# EAGLE design LNA-SMA (EAGLE 7.2.0)
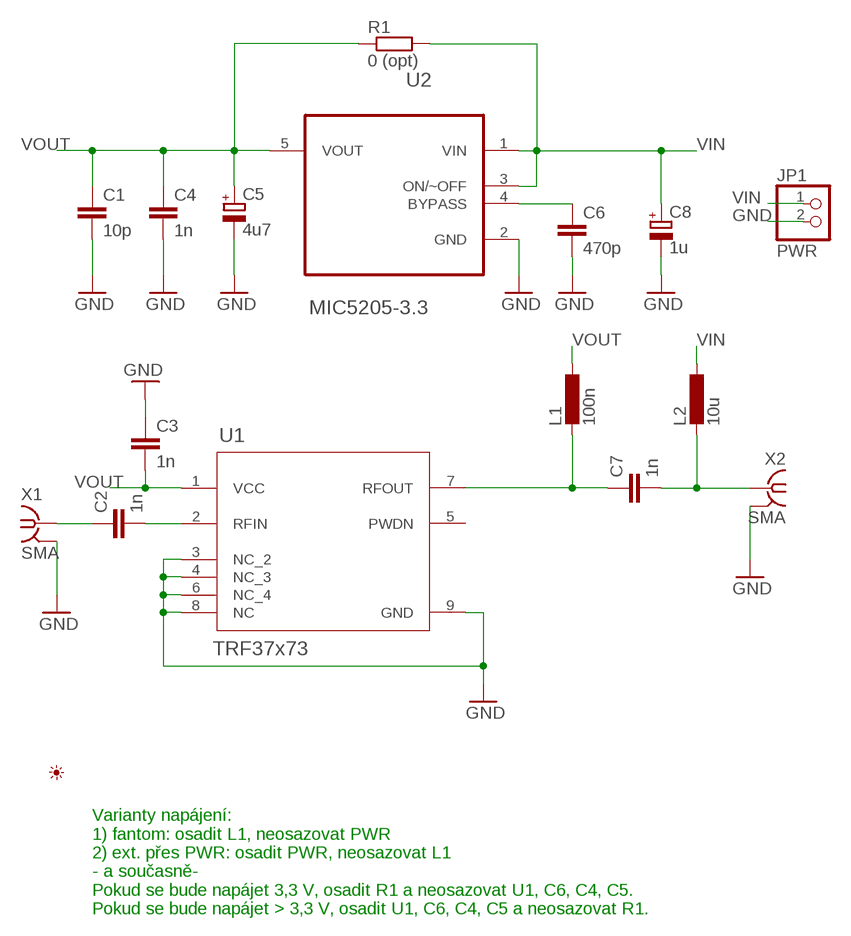
[diagram p0: schematic, sheet 1]

## Parts
C1  10p  C-EUC0603  [C0603]
C2  1n  C-EUC0603  [C0603]
C3  1n  C-EUC0603  [C0603]
C4  1n  C-EUC0603  [C0603]
C5  4u7  CPOL-EUSMCA  [SMC_A]
C6  470p  C-EUC0603  [C0603]
C7  1n  C-EUC0603  [C0603]
C8  1u  CPOL-EUSMCA  [SMC_A]
JP1  PWR  PINHD-1X2  [1X02]
L1  100n  L-EUL2012C  [L2012C]
L2  10u  L-EUL2012C  [L2012C]
R1  0 (opt)  R-EU_R0603  [R0603]
U1  TRF37x73  TRF37D73IDSGR  [DSG0008A]
U2  MIC5205-3.3  LP2985A-18DBVJ  [SOT95P280X145-5N]
U$1  PICTO_1  [PICTO_1]
X1  SMA  SMA-142-0701-801/806  [J502-ND-142-0701-801/806]
X2  SMA  SMA-142-0701-801/806  [J502-ND-142-0701-801/806]

## Nets
GND: C1.2 C3.1 C4.2 C5.- C6.2 C8.- JP1.2 U1.3(NC_2) U1.4(NC_3) U1.6(NC_4) U1.8(NC) U1.9(GND) U2.2(GND) X1.G@1 X1.G@2 X1.G@3 X1.G@4 X2.G@1 X2.G@2 X2.G@3 X2.G@4
N$1 [net]: C6.1 U2.4(BYPASS)
N$2 [RF]: C2.2 U1.2(RFIN)
N$3 [RF]: C7.1 L1.2 U1.7(RFOUT)
RF_IN [RF]: C7.2 L2.2 X2.1
RF_OUT [RF]: C2.1 X1.1
VIN [net]: C8.+ JP1.1 L2.1 R1.2 U2.1(VIN) U2.3(ON/~OFF)
VOUT [net]: C1.1 C3.2 C4.1 C5.+ L1.1 R1.1 U1.1(VCC) U2.5(VOUT)
Unconnected: U1.5(PWDN)

## Notes on the sheet
- Varianty napájení:
  1) fantom: osadit L1, neosazovat PWR
  2) ext. přes PWR: osadit PWR, neosazovat L1
  - a současně-
  Pokud se bude napájet 3,3 V, osadit R1 a neosazovat U1, C6, C4, C5.
  Pokud se bude napájet > 3,3 V, osadit U1, C6, C4, C5 a neosazovat R1.

## Library data of the parts
C1-C4 C6 C7 = rcl:C-EU: CAPACITOR, European symbol
C5 C8 = rcl:CPOL-EU: POLARIZED CAPACITOR, European symbol
JP1 = pinhead:PINHD-1X2: PIN HEADER
L1 L2 = rcl:L-EU: INDUCTOR, European symbol
R1 = rcl:R-EU_: RESISTOR, European symbol
U1 = Texas Instruments:TRF37D73IDSGR; ALTERNATEPARTNUMBER: TRF37D73IDSGT; APPLICATION_BUILDNUMBER: *; COMPTYPE: IC; MANUFACTURER: Texas Instruments; MOUNTTYPE: SMT; PACKAGEREFERENCE: DSG0008A; PARTNUMBER: TRF37D73IDSGR; PIN_COUNT: 9; REFDES: RefDes; ROHS: Y; TYPE: TYPE; VALUE: Value
U2 = Texas Instruments_By_element14_Batch_1:LP2985A-18DBVJ: 150-mA LOW-NOISE LOW-DROPOUT REGULATOR; MPN: LP2985A-18DBVJ; OC_FARNELL: 1924808; OC_NEWARK: 58T1987; PACKAGE: SOT-23-5; SUPPLIER: Texas Instruments
U$1 = My_Picto:PICTO_1: Zdenek Brichacek; OK3ZB; http://blog.brichacek.net
X1 X2 = con-coax:SMA-: SMA 50 Ohm End Launch Jack Receptacle - Round Contact Johnson Components Source: www.johnsoncomponents.com .. J502-ND.pdf; MF: JOHNSON COMPONENTS; MPN: 142-0701-801; OC_FARNELL: 1608592; OC_NEWARK: 90F2624

## Net classes
1 RF: width 2.4 mm, clearance 0.406 mm
2 net: width 0.6 mm, clearance 0.254 mm

## Board
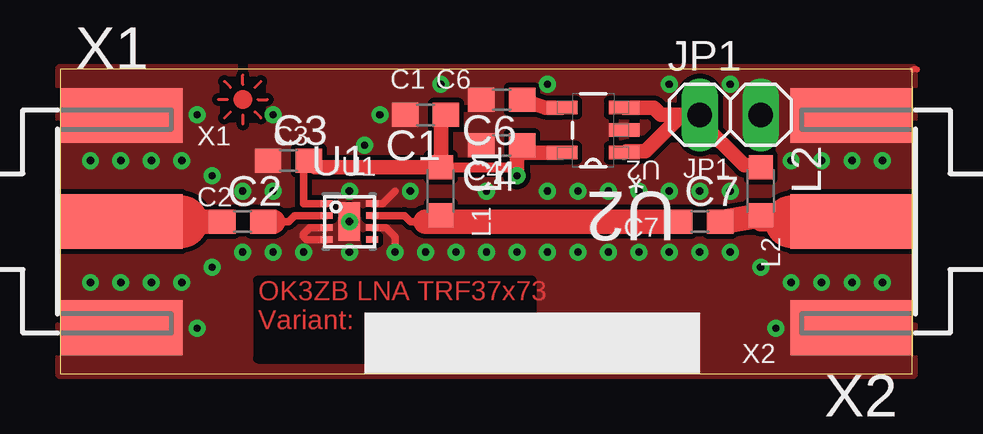
[diagram p1: board, top side]
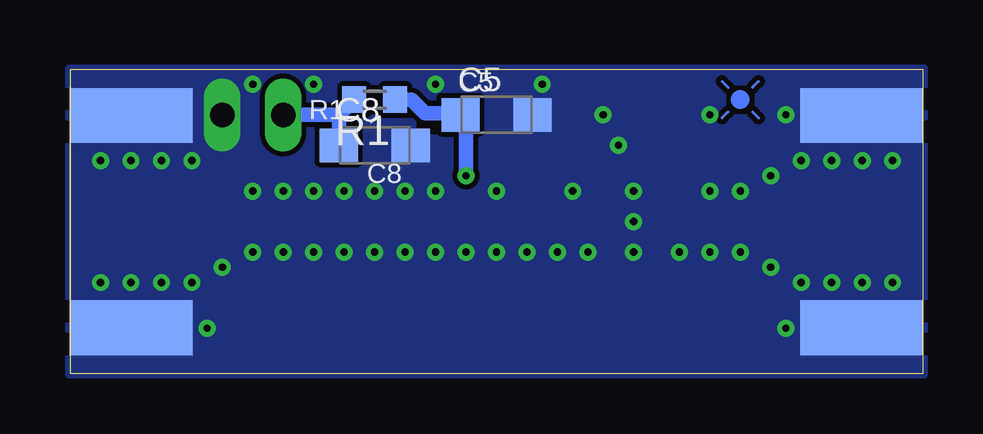
[diagram p2: board, bottom side, seen from below]

Size 35.56 x 12.7 mm. Coordinates in mm from the lower left corner, seen from the top.
Outline: 0,0 35.54,0 35.54,12.7 0,12.7 0,0
Copper layers (1*16): Top 0.035mm / dielectric 1.5mm / Bottom 0.035mm
Design rules "default *": minimum track width 10mil, minimum drill 24mil, track to track 8mil, track to pad 8mil, pad to pad 8mil, via to via 8mil, smd to smd 8mil, copper to edge 0mil, drill to drill 8mil, minimum pad ring 10mil, minimum via ring 8mil, stop-mask expansion 4mil, vias tented up to drill 0mil, thermal gap 0mil

### Footprints (pad centres in the part's own frame; a part is rotated, then mirrored left to right if it is on the bottom)
C0603 = smd 1.1 x 1: 1 -0.85,0; 2 0.85,0
SMC_A = smd 1.6 x 1.4: + -1.5,0; - 1.5,0
1X02 = drill 1.016 long: 1 -1.27,0; 2 1.27,0
L2012C = smd 1 x 1: 1 -1,0; 2 1,0
R0603 = smd 1 x 1.1: 1 -0.85,0; 2 0.85,0
DSG0008A = smd 0.508 x 0.254: 1 -0.95,0.75; 2 -0.95,0.25; 3 -0.95,-0.25; 4 -0.95,-0.75; 5 0.95,-0.75; 6 0.95,-0.25; 7 0.95,0.25; 8 0.95,0.75 | smd 0.889 x 1.6: 9 0,0 | smd 0.508 x 0.508: V 0,0.4
SOT95P280X145-5N = smd 1.27 x 0.559: 1 -1.295,0.94; 2 -1.295,0; 3 -1.295,-0.94; 4 1.295,-0.94; 5 1.295,0.94
J502-ND-142-0701-801/806 = smd 5.08 x 2.286: 1 2.565,0; G@1 2.565,4.42; G@2 2.565,-4.42 | smd 5.08 x 2.286 bottom: G@3 2.565,4.42; G@4 2.565,-4.42

### Placement (x,y rotation side)
C1  15.24,10.79 180 top
C2  7.62,6.35 0 top
C3  9.53,8.89 0 top
C4  18.41,9.53 180 top
C5  17.78,10.79 0 bottom
C6  18.41,11.43 180 top
C7  26.67,6.35 0 top
C8  22.86,9.53 0 bottom
JP1  27.94,10.79 0 top
L1  15.88,7.62 270 top
L2  29.21,7.62 270 top
R1  22.86,11.43 180 bottom
U1  12.06,6.35 0 top
U2  22.23,10.16 180 top
U$1  7.62,11.43 0 top
X1  0,6.35 0 top
X2  35.56,6.35 180 top

### Tracks (layer width: path | path; a pad name or v marks a point on that pad's centre or on a via)
GND  (via drill 0.3)
  Top 0.254: 32.87,11.09 X2.G@4 | 35.73,12.69 35.56,12.69
  Top 0.305: U1.3 10.41,6.1 10.16,5.85 10.16,5.71 10.28,5.6 U1.4 | U1.6 13.59,6.1 13.97,5.71 v13.97,5.08 | U1.8 13.45,7.1 13.97,7.62
  other vias: 25.4,12.06 1.27,8.89 2.54,8.89 3.81,8.89 1.27,3.81 2.54,3.81 3.81,3.81 30.48,3.81 31.75,3.81 33.02,3.81 34.29,3.81 34.29,8.89 33.02,8.89 31.75,8.89 30.48,8.89 27.94,12.06 14.61,7.62 13.34,10.79 27.94,7.62 25.4,7.62 29.21,4.45 5.08,8.89 6.35,8.26 8.89,7.62 7.62,7.62 5.08,3.81 6.35,4.45 7.62,5.08 8.89,5.08 10.16,5.08 12.06,5.08 15.24,5.08 16.51,5.08 17.78,5.08 19.05,5.08 20.32,5.08 21.59,5.08 22.86,5.08 24.13,5.08 25.4,5.08 26.67,5.08 12.06,7.62 5.71,10.79 5.71,1.91 29.84,1.91 17.78,7.62 22.86,7.62 20.32,7.62 21.59,7.62 24.13,7.62 27.94,5.08 26.67,7.62 12.7,9.53 15.88,12.06 20.32,12.06 8.89,10.79 12.06,6.35
  pour Top: 0,12.7 0,0 35.56,0 35.56,12.7
  pour Bottom: 0,12.7 0,0 35.56,0 35.56,12.7
N$1
  Top 0.6: C6.1 20.23,11.1 U2.4
N$2
  Top 0.305: U1.2 9.78,6.6 9.53,6.35 8.89,6.35
  Top 1.016: C2.2 8.89,6.35
N$3
  Top 0.305: L1.2 15.61,6.35 15.24,6.35 14.61,6.35 14.36,6.6 U1.7
  Top 1.016: C7.1 15.24,6.35
RF_IN
  Top 0.813: 30.48,6.35 29.21,6.35 L2.2
  Top 1.016: L2.2 27.67,6.35 C7.2
  Top 2.184: X2.1 30.48,6.35
RF_OUT
  Top 1.016: 5.08,6.35 C2.1
  Top 2.184: X1.1 5.08,6.35
VIN
  Top 0.6: 24.75,11.1 U2.3 | 26.35,10.63 JP1.1 26.7,10.52 28.52,8.69 29.21,8.69 L2.1 | 24.41,9.27 23.61,9.27 U2.1
  Top 0.61: 24.75,11.1 25.06,10.79 JP1.1 25.93,10.79 24.41,9.27
  Bottom 0.61: R1.2 24.34,10.79 | 24.34,10.79 JP1.1 | C8.+ 24.34,9.54 24.34,10.79
VOUT  (via drill 0.3)
  Top 0.305: U1.1 10.16,7.1 10.16,8.68 C3.2 10.64,8.62
  Top 0.406: L1.1 18.78,8.62 19.05,8.89
  Top 0.61: 10.64,8.62 L1.1 15.88,10.58 C1.1 | U2.5 19.38,9.22 19.38,9.41 C4.1 19.05,9.31 19.05,8.89 v19.05,8.26
  Bottom 0.305: 19.05,10.79 C5.+
  Bottom 0.6: R1.1 21.32,11.43 20.75,10.86 19.38,10.86 C5.+
  Bottom 0.61: v19.05,8.26 19.05,10.79

### Text on the board
Top: OK3ZB LNA TRF37x73 / Variant:
_tNames: C1 | C6 | X1 | C3 | C4 | U2 | U1 | JP1 | C2 | L1 | C7 | L2 | X2
_bNames: C5 | R1 | C8